# Altium schematic sheet PP9_OlimexProto.SchDoc
size B
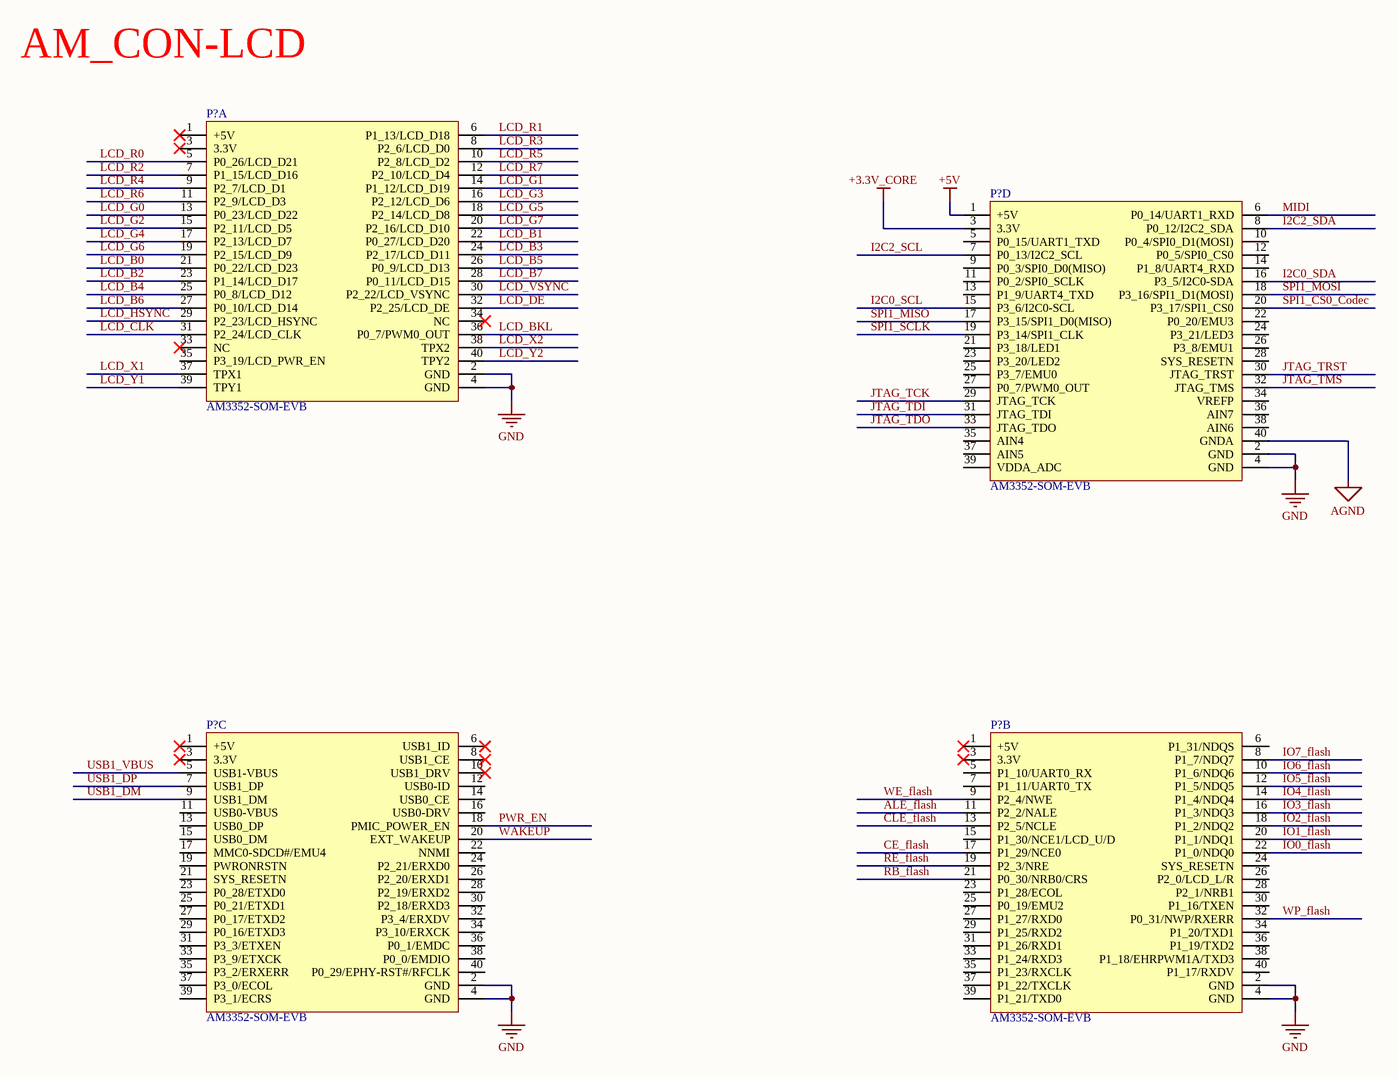
[diagram p0: PP9_OlimexProto.SchDoc]

## Parts
(Parts that share a designator on the sheet are numbered #1, #2 ... from top to bottom, then left to right.)
P?#1  AM3352-SOM-EVB  (part A of 4)
P?#2  AM3352-SOM-EVB  (part D of 4)
P?#3  AM3352-SOM-EVB  (part C of 4)
P?#4  AM3352-SOM-EVB  (part B of 4)

## Nets
+3.3V_CORE: P?#2.3(3.3V)
+5V: P?#2.1(+5V)
AGND: P?#2.40(GNDA)
GND: P?#1.2(GND) P?#1.4(GND) P?#2.2(GND) P?#2.4(GND) P?#3.2(GND) P?#3.4(GND) P?#4.2(GND) P?#4.4(GND)
ALE_flash: P?#4.11(P2_2/NALE)
CE_flash: P?#4.17(P1_29/NCE0)
CLE_flash: P?#4.13(P2_5/NCLE)
I2C0_SCL: P?#2.15(P3_6/I2C0-SCL)
I2C0_SDA: P?#2.16(P3_5/I2C0-SDA)
I2C2_SCL: P?#2.7(P0_13/I2C2_SCL)
I2C2_SDA: P?#2.8(P0_12/I2C2_SDA)
IO0_flash: P?#4.22(P1_0/NDQ0)
IO1_flash: P?#4.20(P1_1/NDQ1)
IO2_flash: P?#4.18(P1_2/NDQ2)
IO3_flash: P?#4.16(P1_3/NDQ3)
IO4_flash: P?#4.14(P1_4/NDQ4)
IO5_flash: P?#4.12(P1_5/NDQ5)
IO6_flash: P?#4.10(P1_6/NDQ6)
IO7_flash: P?#4.8(P1_7/NDQ7)
JTAG_TCK: P?#2.29(JTAG_TCK)
JTAG_TDI: P?#2.31(JTAG_TDI)
JTAG_TDO: P?#2.33(JTAG_TDO)
JTAG_TMS: P?#2.32(JTAG_TMS)
JTAG_TRST: P?#2.30(JTAG_TRST)
LCD_B0: P?#1.21(P0_22/LCD_D23)
LCD_B1: P?#1.22(P0_27/LCD_D20)
LCD_B2: P?#1.23(P1_14/LCD_D17)
LCD_B3: P?#1.24(P2_17/LCD_D11)
LCD_B4: P?#1.25(P0_8/LCD_D12)
LCD_B5: P?#1.26(P0_9/LCD_D13)
LCD_B6: P?#1.27(P0_10/LCD_D14)
LCD_B7: P?#1.28(P0_11/LCD_D15)
LCD_BKL: P?#1.36(P0_7/PWM0_OUT)
LCD_CLK: P?#1.31(P2_24/LCD_CLK)
LCD_DE: P?#1.32(P2_25/LCD_DE)
LCD_G0: P?#1.13(P0_23/LCD_D22)
LCD_G1: P?#1.14(P1_12/LCD_D19)
LCD_G2: P?#1.15(P2_11/LCD_D5)
LCD_G3: P?#1.16(P2_12/LCD_D6)
LCD_G4: P?#1.17(P2_13/LCD_D7)
LCD_G5: P?#1.18(P2_14/LCD_D8)
LCD_G6: P?#1.19(P2_15/LCD_D9)
LCD_G7: P?#1.20(P2_16/LCD_D10)
LCD_HSYNC: P?#1.29(P2_23/LCD_HSYNC)
LCD_R0: P?#1.5(P0_26/LCD_D21)
LCD_R1: P?#1.6(P1_13/LCD_D18)
LCD_R2: P?#1.7(P1_15/LCD_D16)
LCD_R3: P?#1.8(P2_6/LCD_D0)
LCD_R4: P?#1.9(P2_7/LCD_D1)
LCD_R5: P?#1.10(P2_8/LCD_D2)
LCD_R6: P?#1.11(P2_9/LCD_D3)
LCD_R7: P?#1.12(P2_10/LCD_D4)
LCD_VSYNC: P?#1.30(P2_22/LCD_VSYNC)
LCD_X1: P?#1.37(TPX1)
LCD_X2: P?#1.38(TPX2)
LCD_Y1: P?#1.39(TPY1)
LCD_Y2: P?#1.40(TPY2)
MIDI: P?#2.6(P0_14/UART1_RXD)
PWR_EN: P?#3.18(PMIC_POWER_EN)
RB_flash: P?#4.21(P0_30/NRB0/CRS)
RE_flash: P?#4.19(P2_3/NRE)
SPI1_CS0_Codec: P?#2.20(P3_17/SPI1_CS0)
SPI1_MISO: P?#2.17(P3_15/SPI1_D0(MISO))
SPI1_MOSI: P?#2.18(P3_16/SPI1_D1(MOSI))
SPI1_SCLK: P?#2.19(P3_14/SPI1_CLK)
USB1_DM: P?#3.9(USB1_DM)
USB1_DP: P?#3.7(USB1_DP)
USB1_VBUS: P?#3.5(USB1-VBUS)
WAKEUP: P?#3.20(EXT_WAKEUP)
WE_flash: P?#4.9(P2_4/NWE)
WP_flash: P?#4.32(P0_31/NWP/RXERR)

Not connected (* = marked no-connect by the designer): P?#1 1(+5V)* 3(3.3V)* 33(NC)* 34(NC)* 35(P3_19/LCD_PWR_EN); P?#2 5(P0_15/UART1_TXD) 9(P0_3/SPI0_D0(MISO)) 10(P0_4/SPI0_D1(MOSI)) 11(P0_2/SPI0_SCLK) 12(P0_5/SPI0_CS0) 13(P1_9/UART4_TXD) 14(P1_8/UART4_RXD) 21(P3_18/LED1) 22(P0_20/EMU3) 23(P3_20/LED2) 24(P3_21/LED3) 25(P3_7/EMU0) 26(P3_8/EMU1) 27(P0_7/PWM0_OUT) 28(SYS_RESETN) 34(VREFP) 35(AIN4) 36(AIN7) 37(AIN5) 38(AIN6) 39(VDDA_ADC); P?#3 1(+5V)* 3(3.3V)* 6(USB1_ID)* 8(USB1_CE)* 10(USB1_DRV)* 11(USB0-VBUS) 12(USB0-ID) 13(USB0_DP) 14(USB0_CE) 15(USB0_DM) 16(USB0-DRV) 17(MMC0-SDCD#/EMU4) 19(PWRONRSTN) 21(SYS_RESETN) 22(NNMI) 23(P0_28/ETXD0) 24(P2_21/ERXD0) 25(P0_21/ETXD1) 26(P2_20/ERXD1) 27(P0_17/ETXD2) 28(P2_19/ERXD2) 29(P0_16/ETXD3) 30(P2_18/ERXD3) 31(P3_3/ETXEN) 32(P3_4/ERXDV) 33(P3_9/ETXCK) 34(P3_10/ERXCK) 35(P3_2/ERXERR) 36(P0_1/EMDC) 37(P3_0/ECOL) 38(P0_0/EMDIO) 39(P3_1/ECRS) 40(P0_29/EPHY-RST#/RFCLK); P?#4 1(+5V)* 3(3.3V)* 5(P1_10/UART0_RX) 6(P1_31/NDQS) 7(P1_11/UART0_TX) 15(P1_30/NCE1/LCD_U/D) 23(P1_28/ECOL) 24(SYS_RESETN) 25(P0_19/EMU2) 26(P2_0/LCD_L/R) 27(P1_27/RXD0) 28(P2_1/NRB1) 29(P1_25/RXD2) 30(P1_16/TXEN) 31(P1_26/RXD1) 33(P1_24/RXD3) 34(P1_20/TXD1) 35(P1_23/RXCLK) 36(P1_19/TXD2) 37(P1_22/TXCLK) 38(P1_18/EHRPWM1A/TXD3) 39(P1_21/TXD0) 40(P1_17/RXDV)

## Notes on the sheet
- AM_CON-LCD

## Library data of the parts
P?#1-P?#4 = AM3352-SOM-EVB: Protoboard Olimex